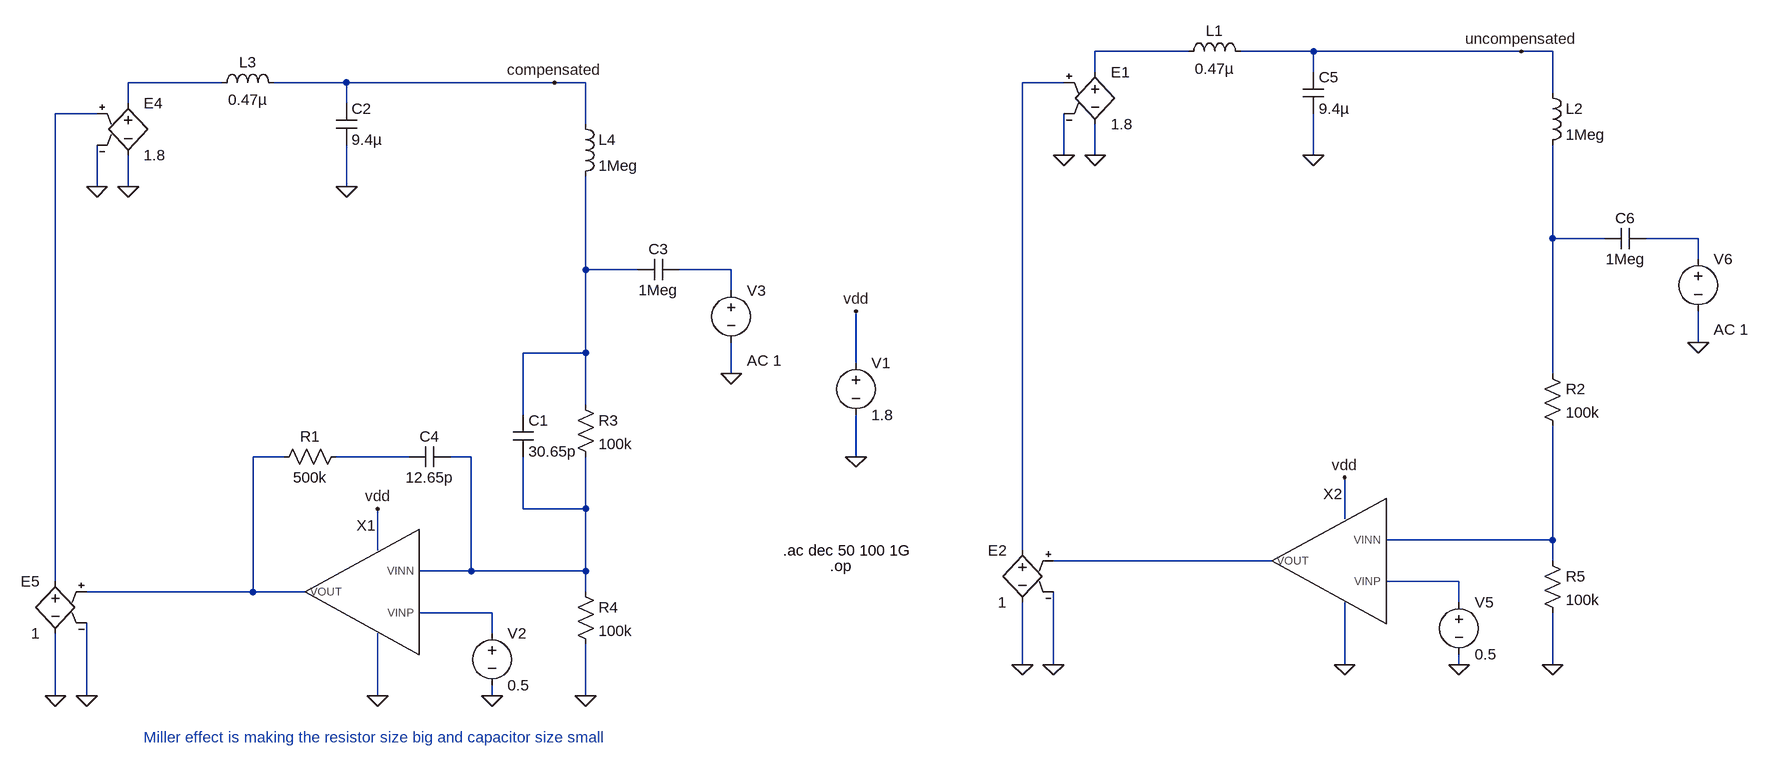
[diagram p0: schematic Compensator.asc]
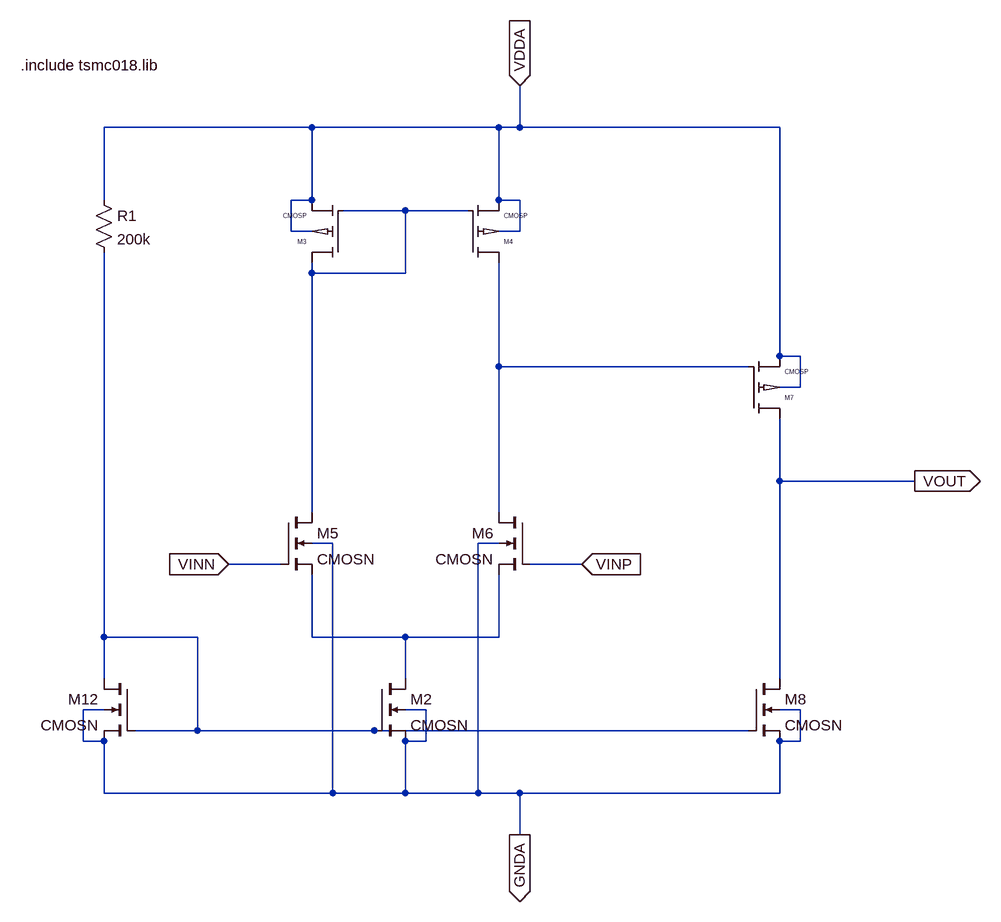
[diagram p1: sub-circuit error_amplifier.asc]
Compensator.asc, the LTspice schematic file:
Version 4
SHEET 1 1376 912
WIRE 512 -160 368 -160
WIRE 704 -160 592 -160
WIRE 1024 -160 704 -160
WIRE 1072 -160 1024 -160
WIRE 368 -128 368 -160
WIRE 704 -128 704 -160
WIRE -976 -112 -1120 -112
WIRE -784 -112 -896 -112
WIRE -464 -112 -784 -112
WIRE -416 -112 -464 -112
WIRE 320 -112 256 -112
WIRE 1072 -96 1072 -160
WIRE -1120 -80 -1120 -112
WIRE -784 -80 -784 -112
WIRE -1168 -64 -1232 -64
WIRE -416 -48 -416 -112
WIRE 320 0 320 -64
WIRE 368 0 368 -48
WIRE 704 0 704 -64
WIRE -1168 48 -1168 -16
WIRE -1120 48 -1120 0
WIRE -784 48 -784 -16
WIRE 1072 128 1072 -16
WIRE 1152 128 1072 128
WIRE 1296 128 1216 128
WIRE 1296 160 1296 128
WIRE -416 176 -416 32
WIRE -336 176 -416 176
WIRE -192 176 -272 176
WIRE -192 208 -192 176
WIRE 1296 288 1296 240
WIRE -416 304 -416 176
WIRE -416 304 -512 304
WIRE 0 320 0 240
WIRE -192 336 -192 288
WIRE 1072 336 1072 128
WIRE -416 384 -416 304
WIRE -512 400 -512 304
WIRE -880 464 -928 464
WIRE -688 464 -800 464
WIRE -592 464 -624 464
WIRE 0 464 0 400
WIRE -512 544 -512 464
WIRE -416 544 -416 464
WIRE -416 544 -512 544
WIRE 752 560 752 496
WIRE 1072 592 1072 416
WIRE 1072 592 816 592
WIRE -736 608 -736 544
WIRE 256 608 256 -112
WIRE 640 624 304 624
WIRE 1072 624 1072 592
WIRE -592 640 -592 464
WIRE -592 640 -672 640
WIRE -416 640 -416 544
WIRE -416 640 -592 640
WIRE -1232 656 -1232 -64
WIRE 928 656 816 656
WIRE -928 672 -928 464
WIRE -928 672 -1184 672
WIRE -848 672 -928 672
WIRE -416 672 -416 640
WIRE 928 688 928 656
WIRE -560 704 -672 704
WIRE -560 736 -560 704
WIRE 256 784 256 688
WIRE 304 784 304 672
WIRE 752 784 752 688
WIRE 928 784 928 768
WIRE 1072 784 1072 704
WIRE -1232 832 -1232 736
WIRE -1184 832 -1184 720
WIRE -736 832 -736 736
WIRE -560 832 -560 816
WIRE -416 832 -416 752
FLAG -1120 48 0
FLAG -1168 48 0
FLAG -1232 832 0
FLAG -1184 832 0
FLAG -736 832 0
FLAG 0 464 0
FLAG 0 240 vdd
FLAG -736 544 vdd
FLAG -784 48 0
FLAG -416 832 0
FLAG -560 832 0
FLAG -464 -112 compensated
FLAG -192 336 0
FLAG 368 0 0
FLAG 320 0 0
FLAG 256 784 0
FLAG 304 784 0
FLAG 752 784 0
FLAG 752 496 vdd
FLAG 704 0 0
FLAG 1072 784 0
FLAG 928 784 0
FLAG 1024 -160 uncompensated
FLAG 1296 288 0
SYMBOL e -1120 -96 R0
SYMATTR InstName E4
SYMATTR Value 1.8
SYMBOL ind -992 -96 R270
WINDOW 0 32 56 VTop 2
WINDOW 3 5 56 VBottom 2
SYMATTR InstName L3
SYMATTR Value 0.47µ
SYMATTR SpiceLine Rser=32m
SYMBOL cap -800 -80 R0
SYMATTR InstName C2
SYMATTR Value 9.4µ
SYMBOL e -1232 640 M0
SYMATTR InstName E5
SYMATTR Value 1
SYMBOL Error_Amplifier -752 688 M0
SYMATTR InstName X1
SYMBOL voltage 0 304 R0
WINDOW 123 0 0 Left 0
WINDOW 39 0 0 Left 0
SYMATTR InstName V1
SYMATTR Value 1.8
SYMBOL res -432 368 R0
SYMATTR InstName R3
SYMATTR Value 100k
SYMBOL res -432 656 R0
SYMATTR InstName R4
SYMATTR Value 100k
SYMBOL voltage -560 720 R0
WINDOW 123 0 0 Left 0
WINDOW 39 0 0 Left 0
SYMATTR InstName V2
SYMATTR Value 0.5
SYMBOL cap -272 160 R90
WINDOW 0 0 32 VBottom 2
WINDOW 3 32 32 VTop 2
SYMATTR InstName C3
SYMATTR Value 1Meg
SYMBOL ind -432 -64 R0
SYMATTR InstName L4
SYMATTR Value 1Meg
SYMBOL voltage -192 192 R0
WINDOW 123 24 124 Left 2
WINDOW 39 0 0 Left 0
SYMATTR Value2 AC 1
SYMATTR InstName V3
SYMATTR Value ""
SYMBOL cap -528 400 R0
SYMATTR InstName C1
SYMATTR Value 30.65p
SYMBOL cap -624 448 R90
WINDOW 0 0 32 VBottom 2
WINDOW 3 32 32 VTop 2
SYMATTR InstName C4
SYMATTR Value 12.65p
SYMBOL res -784 448 R90
WINDOW 0 0 56 VBottom 2
WINDOW 3 32 56 VTop 2
SYMATTR InstName R1
SYMATTR Value 500k
SYMBOL e 368 -144 R0
SYMATTR InstName E1
SYMATTR Value 1.8
SYMBOL ind 496 -144 R270
WINDOW 0 32 56 VTop 2
WINDOW 3 5 56 VBottom 2
SYMATTR InstName L1
SYMATTR Value 0.47µ
SYMATTR SpiceLine Rser=32m
SYMBOL cap 688 -128 R0
SYMATTR InstName C5
SYMATTR Value 9.4µ
SYMBOL e 256 592 M0
SYMATTR InstName E2
SYMATTR Value 1
SYMBOL Error_Amplifier 736 640 M0
SYMATTR InstName X2
SYMBOL res 1056 320 R0
SYMATTR InstName R2
SYMATTR Value 100k
SYMBOL res 1056 608 R0
SYMATTR InstName R5
SYMATTR Value 100k
SYMBOL voltage 928 672 R0
WINDOW 123 0 0 Left 0
WINDOW 39 0 0 Left 0
SYMATTR InstName V5
SYMATTR Value 0.5
SYMBOL cap 1216 112 R90
WINDOW 0 0 32 VBottom 2
WINDOW 3 32 32 VTop 2
SYMATTR InstName C6
SYMATTR Value 1Meg
SYMBOL ind 1056 -112 R0
SYMATTR InstName L2
SYMATTR Value 1Meg
SYMBOL voltage 1296 144 R0
WINDOW 123 24 124 Left 2
WINDOW 39 0 0 Left 0
SYMATTR Value2 AC 1
SYMATTR InstName V6
SYMATTR Value ""
TEXT -112 608 Left 2 !.ac dec 50 100 1G
TEXT -40 632 Left 2 !.op
TEXT -1096 896 Left 2 ;Miller effect is making the resistor size big and capacitor size small

error_amplifier.asc, the sub-circuit schematic file:
Version 4
SHEET 1 2700 752
WIRE -384 -1360 -704 -1360
WIRE -96 -1360 -384 -1360
WIRE -64 -1360 -64 -1424
WIRE -64 -1360 -96 -1360
WIRE 336 -1360 -64 -1360
WIRE -704 -1248 -704 -1360
WIRE -384 -1248 -384 -1360
WIRE -384 -1248 -416 -1248
WIRE -96 -1248 -96 -1360
WIRE -64 -1248 -96 -1248
WIRE -240 -1232 -336 -1232
WIRE -144 -1232 -240 -1232
WIRE -416 -1200 -416 -1248
WIRE -384 -1200 -416 -1200
WIRE -64 -1200 -64 -1248
WIRE -64 -1200 -96 -1200
WIRE -384 -1136 -384 -1152
WIRE -240 -1136 -240 -1232
WIRE -240 -1136 -384 -1136
WIRE 336 -1008 336 -1360
WIRE 368 -1008 336 -1008
WIRE -96 -992 -96 -1152
WIRE 288 -992 -96 -992
WIRE 368 -960 368 -1008
WIRE 368 -960 336 -960
WIRE 336 -816 336 -912
WIRE 544 -816 336 -816
WIRE -384 -768 -384 -1136
WIRE -96 -768 -96 -992
WIRE -352 -720 -384 -720
WIRE -96 -720 -128 -720
WIRE -432 -688 -512 -688
WIRE 32 -688 -48 -688
WIRE -704 -576 -704 -1168
WIRE -560 -576 -704 -576
WIRE -384 -576 -384 -672
WIRE -240 -576 -384 -576
WIRE -96 -576 -96 -672
WIRE -96 -576 -240 -576
WIRE -704 -512 -704 -576
WIRE -240 -512 -240 -576
WIRE 336 -512 336 -816
WIRE -704 -464 -736 -464
WIRE -208 -464 -240 -464
WIRE 368 -464 336 -464
WIRE -560 -432 -560 -576
WIRE -560 -432 -656 -432
WIRE -288 -432 -560 -432
WIRE 288 -432 -288 -432
WIRE -736 -416 -736 -464
WIRE -704 -416 -736 -416
WIRE -208 -416 -208 -464
WIRE -208 -416 -240 -416
WIRE 368 -416 368 -464
WIRE 368 -416 336 -416
WIRE -704 -336 -704 -416
WIRE -352 -336 -352 -720
WIRE -352 -336 -704 -336
WIRE -240 -336 -240 -416
WIRE -240 -336 -352 -336
WIRE -128 -336 -128 -720
WIRE -128 -336 -240 -336
WIRE -64 -336 -128 -336
WIRE 336 -336 336 -416
WIRE 336 -336 -64 -336
WIRE -64 -272 -64 -336
FLAG -64 -1424 VDDA
IOPIN -64 -1424 In
FLAG -64 -272 GNDA
IOPIN -64 -272 Out
FLAG 544 -816 VOUT
IOPIN 544 -816 Out
FLAG -512 -688 VINN
IOPIN -512 -688 In
FLAG 32 -688 VINP
IOPIN 32 -688 In
SYMBOL cmosn -656 -512 M0
SYMATTR InstName M12
SYMATTR Value2 l=180n w=1u
SYMBOL cmosn -288 -512 R0
SYMATTR InstName M2
SYMATTR Value2 l=180n w=5u
SYMBOL cmosp -336 -1152 R180
SYMATTR InstName M3
SYMATTR Value2 l=360n w=3u
SYMBOL cmosp -144 -1152 M180
SYMATTR InstName M4
SYMATTR Value2 l=360n w=3u
SYMBOL cmosn -432 -768 R0
SYMATTR InstName M5
SYMATTR Value2 l=360n w=10u
SYMBOL cmosn -48 -768 M0
SYMATTR InstName M6
SYMATTR Value2 l=360n w=10u
SYMBOL cmosp 288 -912 M180
SYMATTR InstName M7
SYMATTR Value2 l=180n w=5u
SYMBOL cmosn 288 -512 R0
SYMATTR InstName M8
SYMATTR Value2 l=180n w=1u
SYMBOL res -720 -1264 R0
SYMATTR InstName R1
SYMATTR Value 200k
TEXT -832 -1456 Left 2 !.include tsmc018.lib

The netlist it stands for:
* Compensator.asc
E4 N002 0 N004 0 1.8
L3 N002 compensated 0.47µ Rser=32m
C2 compensated 0 9.4µ
E5 N004 0 N009 0 1
XX1 vdd N011 N015 0 N009 error_amplifier
V1 vdd 0 1.8
R3 N007 N011 100k
R4 N011 0 100k
V2 N015 0 0.5
C3 N008 N007 1Meg
L4 compensated N007 1Meg
V3 N008 0 AC 1
C1 N007 N011 30.65p
C4 N011 N010 12.65p
R1 N010 N009 500k
E1 N001 0 N003 0 1.8
L1 N001 uncompensated 0.47µ Rser=32m
C5 uncompensated 0 9.4µ
E2 N003 0 N013 0 1
XX2 vdd N012 N014 0 N013 error_amplifier
R2 N005 N012 100k
R5 N012 0 100k
V5 N014 0 0.5
C6 N006 N005 1Meg
L2 uncompensated N005 1Meg
V6 N006 0 AC 1

* block symbol definitions
.subckt error_amplifier VDDA VINN VINP GNDA VOUT
M12 N003 N003 GNDA GNDA CMOSN l=180n w=1u
M2 N004 N003 GNDA GNDA CMOSN l=180n w=5u
M3 N001 N001 VDDA VDDA CMOSP l=360n w=3u
M4 N002 N001 VDDA VDDA CMOSP l=360n w=3u
M5 N001 VINN N004 GNDA CMOSN l=360n w=10u
M6 N002 VINP N004 GNDA CMOSN l=360n w=10u
M7 VOUT N002 VDDA VDDA CMOSP l=180n w=5u
M8 VOUT N003 GNDA GNDA CMOSN l=180n w=1u
R1 VDDA N003 200k
.include tsmc018.lib
.ends error_amplifier

.model NMOS NMOS
.model PMOS PMOS
.lib standard.mos
.ac dec 50 100 1G
.op
* Miller effect is making the resistor size big and capacitor size small
.lib tsmc018.lib
.backanno
.end